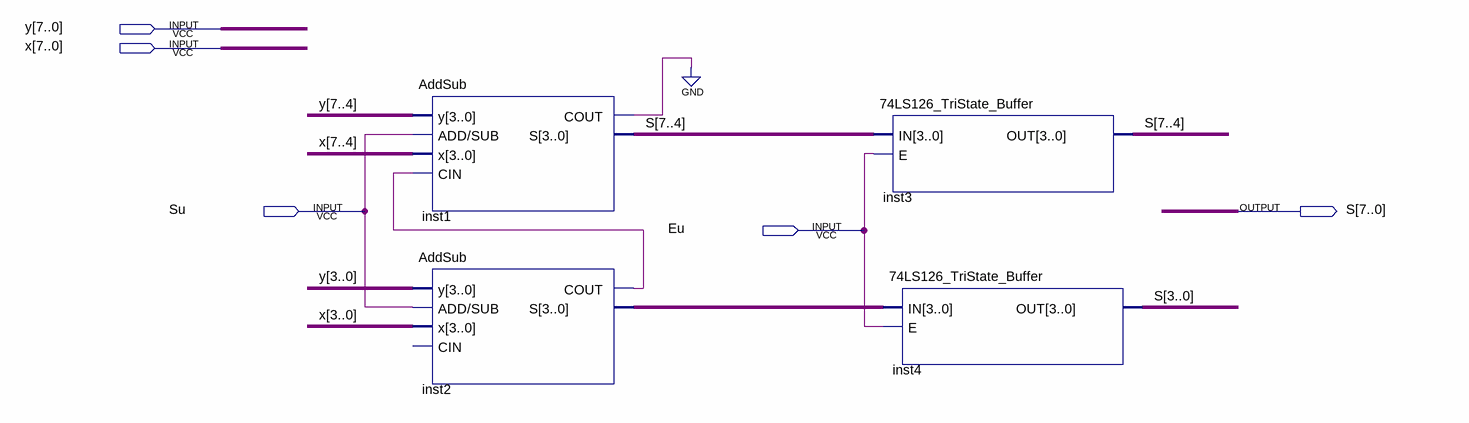
[diagram p0: schematic sheet]
// Quartus schematic ChainAdders.bdf as structural Verilog: 4 symbols, 5 pins
module ChainAdders (
  input  [7:0] y,
  input  [7:0] x,
  input  Su,
  input  Eu,
  output [7:0] S
);

  wire inst1_cout, inst2_cout;
  wire [3:0] inst2_s;

  AddSub inst1 (.y(y[7:4]), .\ADD/SUB (Su), .x(x[7:4]), .CIN(inst2_cout), .COUT(inst1_cout), .S(S[7:4]));
  AddSub inst2 (.y(y[3:0]), .\ADD/SUB (Su), .x(x[3:0]), .COUT(inst2_cout), .S(inst2_s));  // open: CIN
  \74LS126_TriState_Buffer  inst3 (.IN(S[7:4]), .E(Eu), .OUT(S[7:4]));
  \74LS126_TriState_Buffer  inst4 (.IN(inst2_s), .E(Eu), .OUT(S[3:0]));
  // also tied to GND on the sheet: inst1_cout
endmodule
